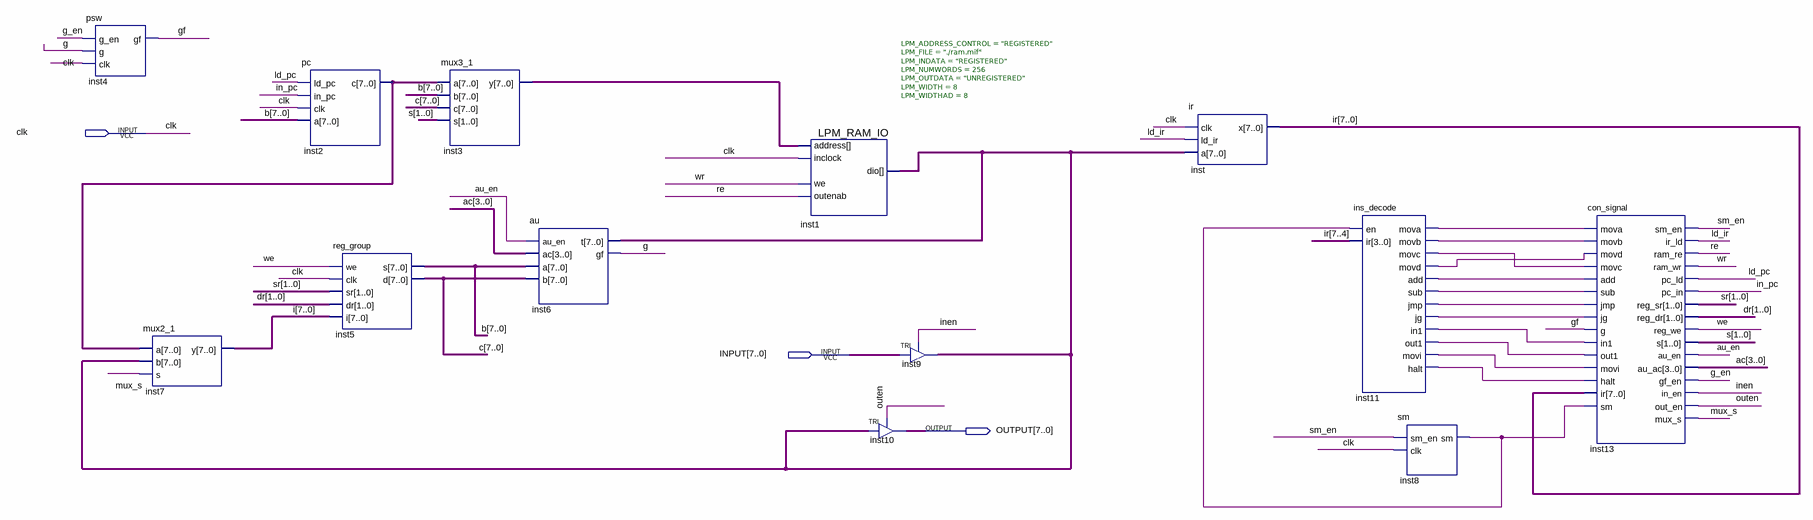
[diagram p0: schematic sheet]
// Quartus schematic small_computer.bdf as structural Verilog: 13 symbols, 3 pins
module small_computer (
  input  clk,
  input  [7:0] INPUT,
  output [7:0] OUTPUT
);

  wire au_en, g, g_en, gf, in_pc, inen, inst8_sm, inst11_add, inst11_halt, inst11_in1, inst11_jg, inst11_jmp,
       inst11_mova, inst11_movb, inst11_movc, inst11_movd, inst11_movi, inst11_out1, inst11_sub, ld_ir,
       ld_pc, mux_s, outen, re, sm_en, we, wr;
  wire [1:0] dr, s, sr;
  wire [3:0] ac;
  wire [7:0] b, c, i, inst2_c, inst3_y, inst6_t, ir;

  psw inst4 (.g_en(g_en), .g(g), .clk(clk), .gf(gf));
  mux2_1 inst7 (.a(inst2_c), .b(inst6_t), .s(mux_s), .y(i));
  pc inst2 (.ld_pc(ld_pc), .in_pc(in_pc), .clk(clk), .a(b), .c(inst2_c));
  reg_group inst5 (.we(we), .clk(clk), .sr(sr), .dr(dr), .i(i), .s(b), .d(c));
  mux3_1 inst3 (.a(inst2_c), .b(b), .c(c), .s(s), .y(inst3_y));
  au inst6 (.au_en(au_en), .ac(ac), .a(b), .b(c), .t(inst6_t), .gf(g));
  LPM_RAM_IO #(.LPM_ADDRESS_CONTROL("REGISTERED"), .LPM_FILE("./ram.mif"), .LPM_INDATA("REGISTERED"), .LPM_NUMWORDS(256), .LPM_OUTDATA("UNREGISTERED"), .LPM_WIDTH(8), .LPM_WIDTHAD(8)) inst1 (
    .address(inst3_y), .inclock(clk), .we(wr), .outenab(re), .dio(inst6_t));
  TRI inst9[7:0] (.IN(INPUT), .OE(inen), .OUT(inst6_t));
  TRI inst10[7:0] (.IN(inst6_t), .OE(outen), .OUT(OUTPUT));
  ir inst (.clk(clk), .ld_ir(ld_ir), .a(inst6_t), .x(ir));
  ins_decode inst11 (
    .en(inst8_sm), .ir(ir[7:4]), .mova(inst11_mova), .movb(inst11_movb), .movc(inst11_movc),
    .movd(inst11_movd), .add(inst11_add), .sub(inst11_sub), .jmp(inst11_jmp), .jg(inst11_jg),
    .in1(inst11_in1), .out1(inst11_out1), .movi(inst11_movi), .halt(inst11_halt));
  sm inst8 (.sm_en(sm_en), .clk(clk), .sm(inst8_sm));
  con_signal inst13 (
    .mova(inst11_mova), .movb(inst11_movb), .movd(inst11_movd), .movc(inst11_movc), .add(inst11_add),
    .sub(inst11_sub), .jmp(inst11_jmp), .jg(inst11_jg), .g(gf), .in1(inst11_in1), .out1(inst11_out1),
    .movi(inst11_movi), .halt(inst11_halt), .ir(ir), .sm(inst8_sm), .sm_en(sm_en), .ir_ld(ld_ir),
    .ram_re(re), .ram_wr(wr), .pc_ld(ld_pc), .pc_in(in_pc), .reg_sr(sr), .reg_dr(dr), .reg_we(we), .s(s),
    .au_en(au_en), .au_ac(ac), .gf_en(g_en), .in_en(inen), .out_en(outen), .mux_s(mux_s));
endmodule
